# EAGLE design echo (EAGLE 9.3.2)
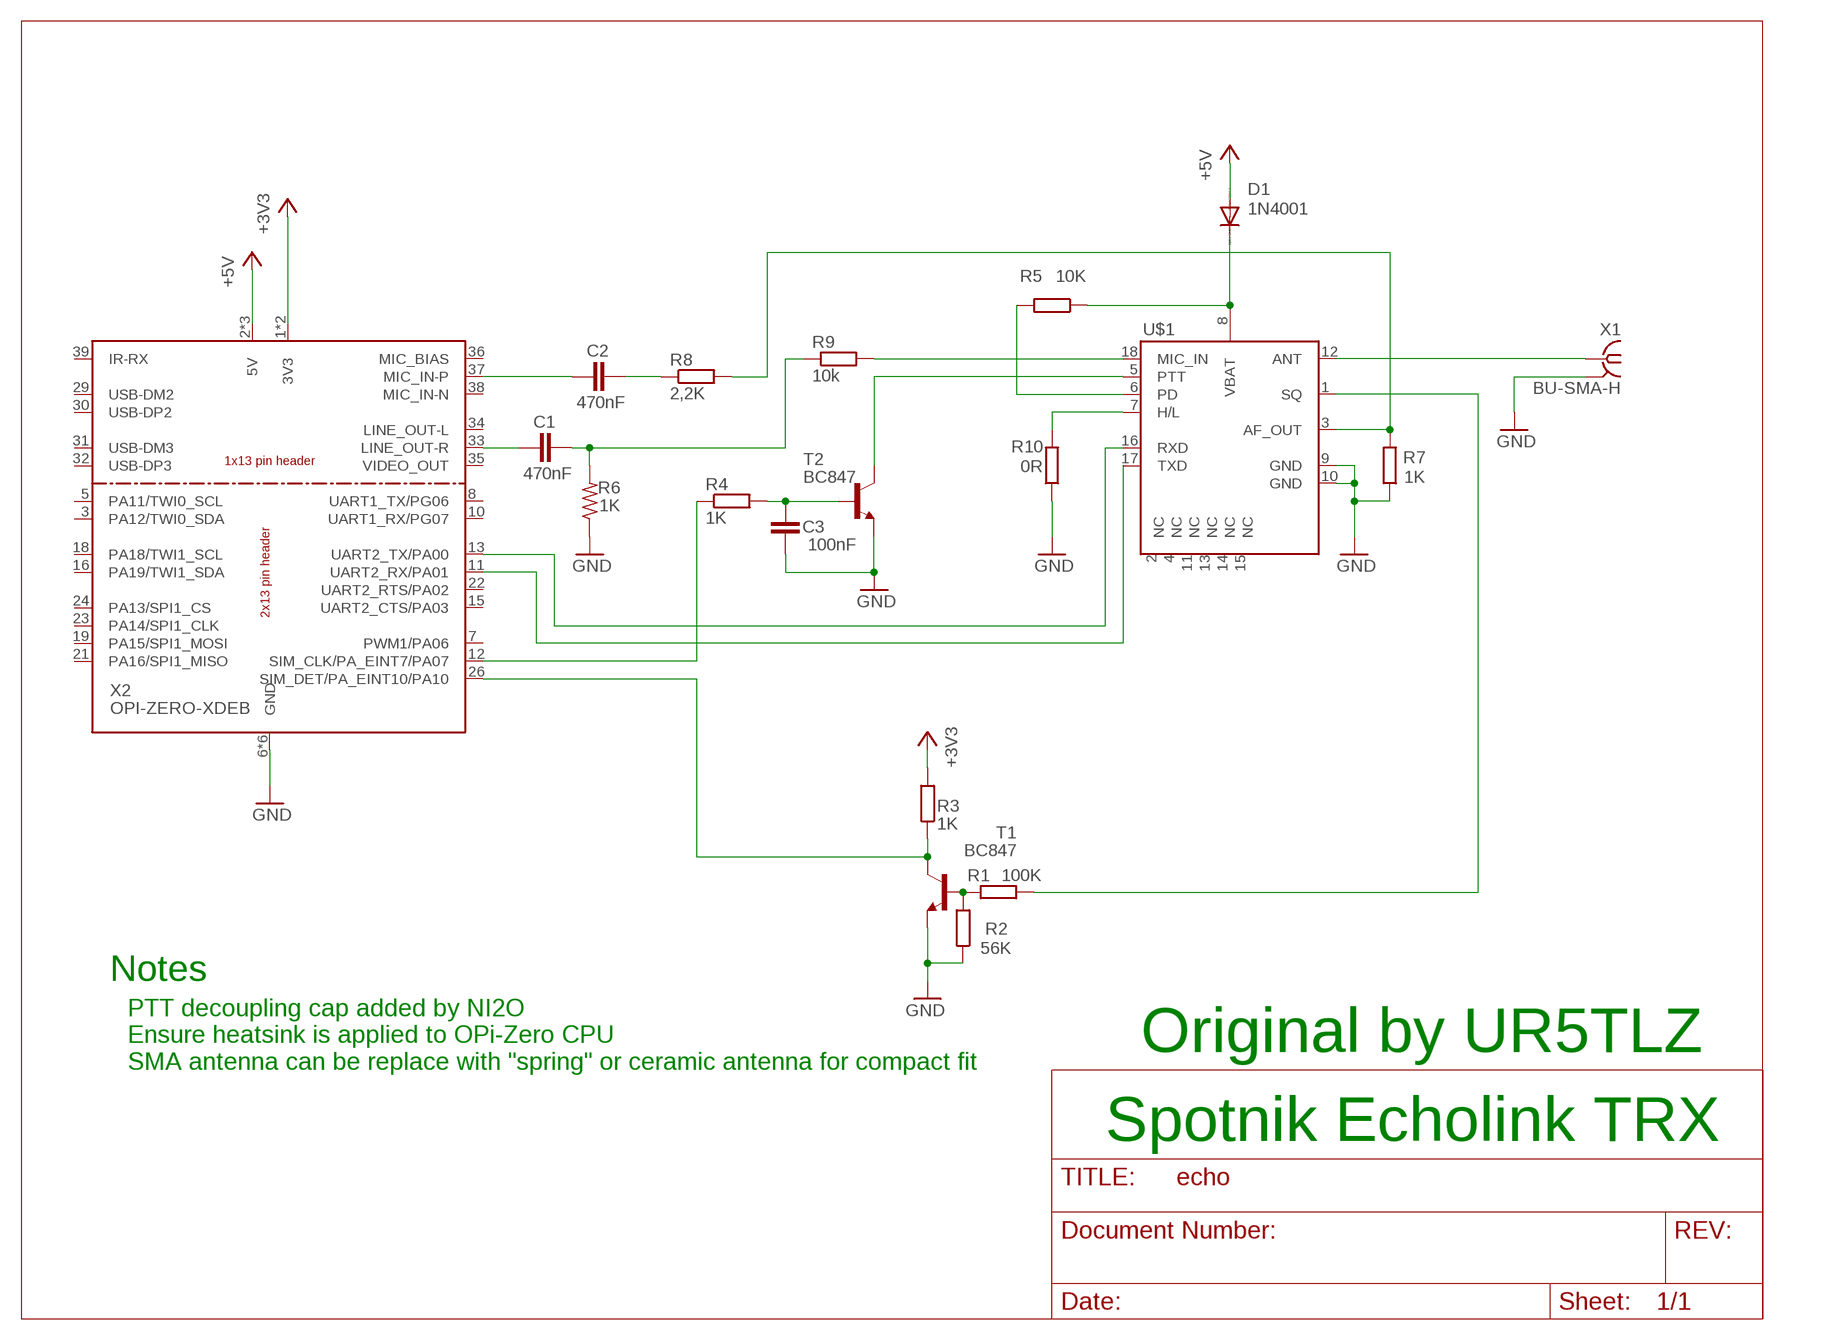
[diagram p0: schematic, sheet 1]

## Parts
C1  470nF  C-EUC0805  [C0805]
C2  470nF  C-EUC0805  [C0805]
C3  100nF  C-EUC0805  [C0805]
D1  1N4001  DIODE-DO41-10  [DO41-10]
R1  100K  R-EU_R0805  [R0805]
R2  56K  R-EU_R0805  [R0805]
R3  1K  R-EU_R0805  [R0805]
R4  1K  R-EU_R0805  [R0805]
R5  10K  R-EU_R0805  [R0805]
R6  1K  R-US_R0805  [R0805]
R7  1K  R-EU_R0805  [R0805]
R8  2,2K  R-EU_R0805  [R0805]
R9  10k  R-EU_R0805  [R0805]
R10  0R  R-EU_R0805  [R0805]
T1  BC847  [SOT23]
T2  BC847  [SOT23]
U$1  DRA818A  [DRA818A]
X1  BU-SMA-H  [BU-SMA-H]
X2  OPI-ZERO-XDEB  [OPIOHATDEB]

## Nets
+3V3: R3.2 X2.1(3V3) X2.17(3V3)
+5V: D1.A X2.2(5V) X2.4(5V) X2.27(5V)
GND: C3.2 R2.1 R6.1 R7.1 R10.1 T1.2(E) T2.2(E) U$1.9(GND) U$1.10(GND) X1.2 X1.3 X1.4 X1.5 X2.6(GND) X2.9(GND) X2.14(GND) X2.20(GND) X2.25(GND) X2.28(GND)
N$1: U$1.12(ANT) X1.1
N$2: R1.2 R2.2 T1.1(B)
N$3: R3.1 T1.3(C) X2.26(SIM_DET/PA_EINT10/PA10)
N$4: D1.C R5.1 U$1.8(VBAT)
N$5: R1.1 U$1.1(SQ)
N$6: C3.1 R4.2 T2.1(B)
N$7: T2.3(C) U$1.5(PTT)
N$8: R4.1 X2.12(SIM_CLK/PA_EINT7/PA07)
N$9: R5.2 U$1.6(PD)
N$10: C1.2 X2.33(LINE_OUT-R)
N$11: C1.1 R6.2 R9.1
N$12: R7.2 R8.2 U$1.3(AF_OUT)
N$13: C2.1 R8.1
N$14: C2.2 X2.37(MIC_IN-P)
N$15: U$1.17(TXD) X2.11(UART2_RX/PA01)
N$16: U$1.16(RXD) X2.13(UART2_TX/PA00)
N$17: R9.2 U$1.18(MIC_IN)
N$18: R10.2 U$1.7(H/L)
Unconnected: U$1.2(NC) U$1.4(NC) U$1.11(NC) U$1.13(NC) U$1.14(NC) U$1.15(NC) X2.3(PA12/TWI0_SDA) X2.5(PA11/TWI0_SCL) X2.7(PWM1/PA06) X2.8(UART1_TX/PG06) X2.10(UART1_RX/PG07) X2.15(UART2_CTS/PA03) X2.16(PA19/TWI1_SDA) X2.18(PA18/TWI1_SCL) X2.19(PA15/SPI1_MOSI) X2.21(PA16/SPI1_MISO) X2.22(UART2_RTS/PA02) X2.23(PA14/SPI1_CLK) X2.24(PA13/SPI1_CS) X2.29(USB-DM2) X2.30(USB-DP2) X2.31(USB-DM3) X2.32(USB-DP3) X2.34(LINE_OUT-L) X2.35(VIDEO_OUT) X2.36(MIC_BIAS) X2.38(MIC_IN-N) X2.39(IR-RX)

## Notes on the sheet
- Notes
- Original by UR5TLZ
- PTT decoupling cap added by NI2O
  Ensure heatsink is applied to OPi-Zero CPU
  SMA antenna can be replace with "spring" or ceramic antenna for compact fit
- Spotnik Echolink TRX

## Library data of the parts
C1-C3 = resistor:C-EU: CAPACITOR, European symbol
D1 = diode:DIODE-: DIODE
R1-R5 R7-R10 = resistor:R-EU_: RESISTOR, European symbol
R6 = resistor:R-US_: RESISTOR, American symbol
T1 T2 = transistor:BC847: NPN TRANSISTOR
U$1 = dorji:DRA818A
X1 = con-coax:BU-SMA-H: FEMALE SMA CONNECTOR Radiall; OC_FARNELL: unknown; OC_NEWARK: unknown
X2 = OrangePi0:OPI-ZERO-X

## Board
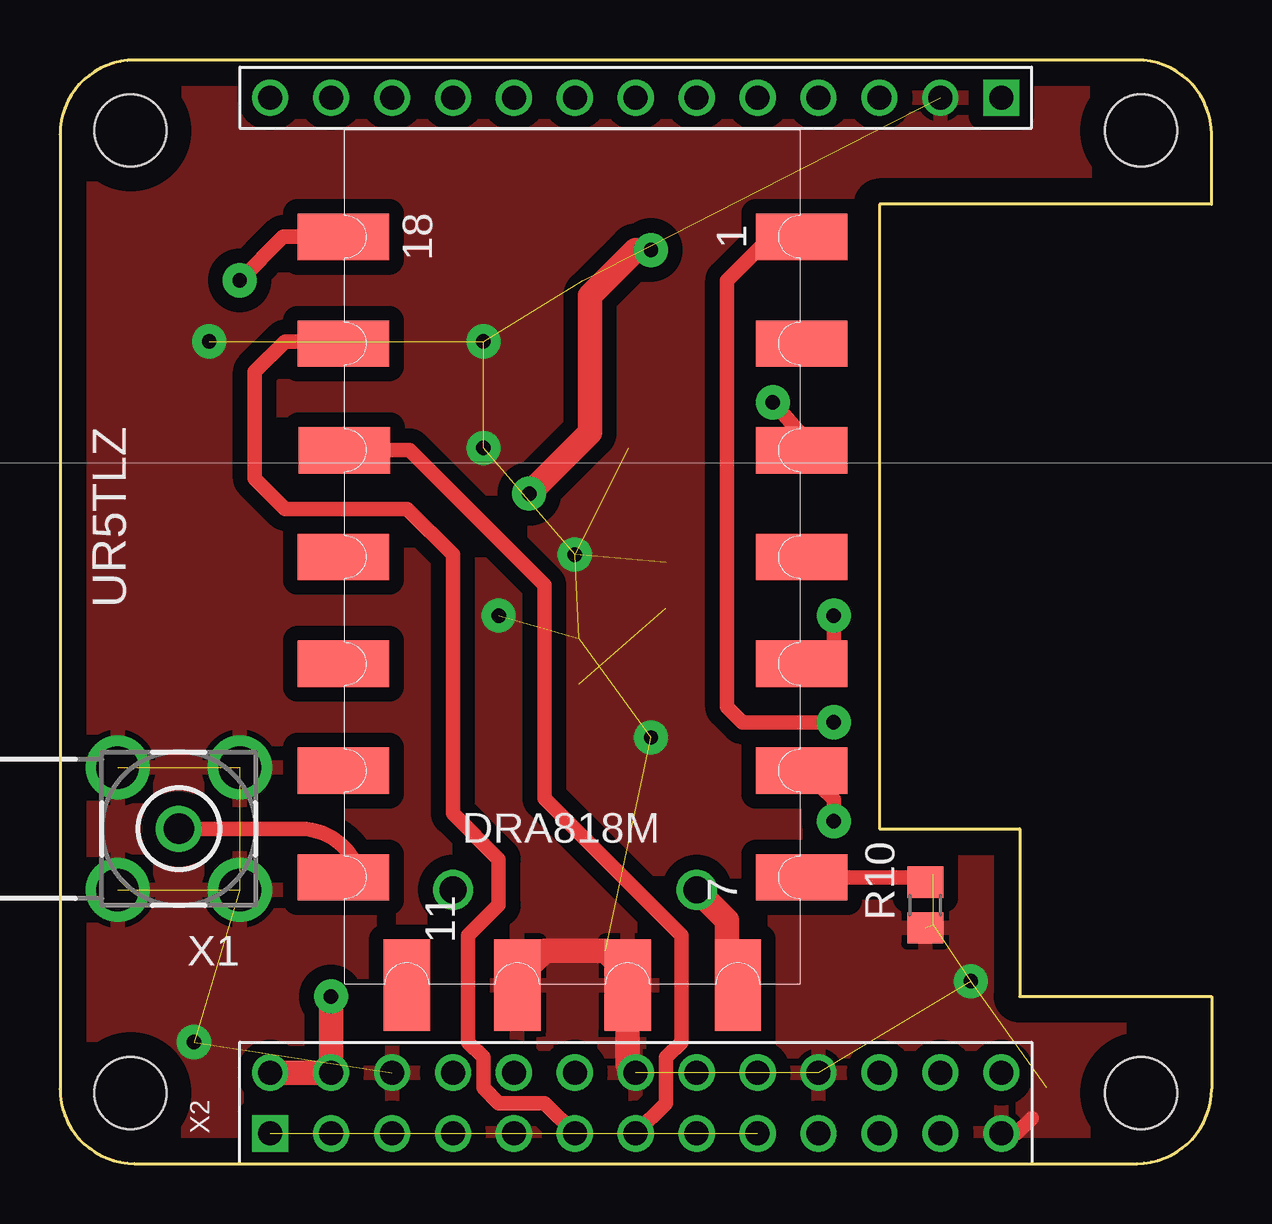
[diagram p1: board, top side]
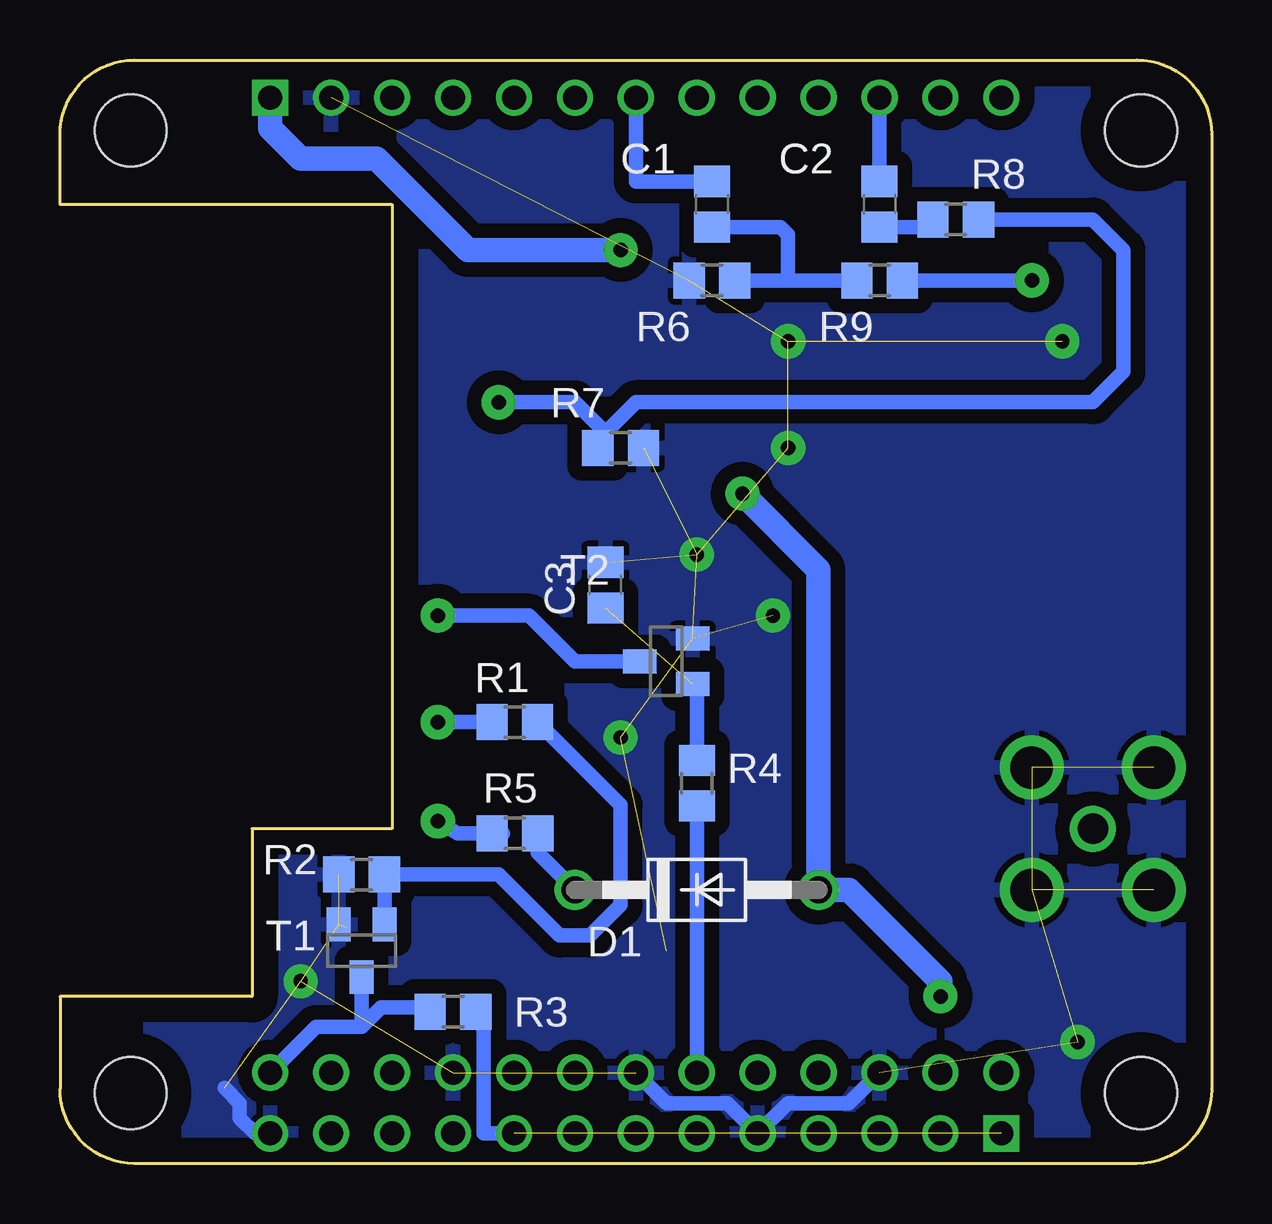
[diagram p2: board, bottom side, seen from below]

Size 48 x 46 mm. Coordinates in mm from the lower left corner, seen from the top.
Copper layers (1*16): Top 0.035mm / dielectric 1.5mm / Bottom 0.035mm
Design rules "default *": minimum track width 10mil, minimum drill 24mil, track to track 8mil, track to pad 8mil, pad to pad 8mil, via to via 8mil, smd to smd 8mil, copper to edge 40mil, drill to drill 8mil, minimum pad ring 10mil, minimum via ring 8mil, stop-mask expansion 4mil, vias tented up to drill 25mil, thermal gap 10mil

### Footprints (pad centres in the part's own frame; a part is rotated, then mirrored left to right if it is on the bottom)
C0805 = smd 1.3 x 1.5: 1 -0.95,0; 2 0.95,0
DO41-10 = drill 1.118: A 5.08,0; C -5.08,0
R0805 = smd 1.3 x 1.5: 1 -0.95,0; 2 0.95,0
SOT23 = smd 1 x 1.4: 1 -0.95,-1.1; 2 0.95,-1.1; 3 0,1.1
DRA818A = smd 3.81 x 1.93: 1 -9.45,-13.25; 2 -9.45,-8.8; 3 -9.45,-4.35; 4 -9.45,0.1; 5 -9.45,4.55; 6 -9.45,9; 7 -9.45,13.45; 12 9.65,13.45; 13 9.65,9; 14 9.65,4.55; 15 9.65,0.1; 16 9.6,-4.35; 17 9.65,-8.8; 18 9.65,-13.25 | smd 1.93 x 3.81: 8 -6.8,17.95; 9 -2.2,17.95; 10 2.4,17.95; 11 7,17.95
BU-SMA-H = drill 1.27: 1 0,0 | drill 1.778: 2 -2.55,2.55; 3 2.55,2.55; 4 2.55,-2.55; 5 -2.55,-2.55
OPIOHATDEB = drill 1 square: 1 0,0; 27 30.48,43.18 | drill 1: 2 0,2.54; 3 2.54,0; 4 2.54,2.54; 5 5.08,0; 6 5.08,2.54; 7 7.62,0; 8 7.62,2.54; 9 10.16,0; 10 10.16,2.54; 11 12.7,0; 12 12.7,2.54; 13 15.24,0; 14 15.24,2.54; 15 17.78,0; 16 17.78,2.54; 17 20.32,0; 18 20.32,2.54; 19 22.86,0; 20 22.86,2.54; 21 25.4,0; 22 25.4,2.54; 23 27.94,0; 24 27.94,2.54; 25 30.48,0; 26 30.48,2.54; 28 27.94,43.18; 29 25.4,43.18; 30 22.86,43.18; 31 20.32,43.18; 32 17.78,43.18; 33 15.24,43.18; 34 12.7,43.18; 35 10.16,43.18; 36 7.62,43.18; 37 5.08,43.18; 38 2.54,43.18; 39 0,43.18 | hole 3: -5.815,1.694; 36.295,1.694; 36.295,41.805; -5.815,41.805

### Placement (x,y rotation side)
C1  20.82,39.99 90 bottom
C2  13.84,39.99 90 bottom
C3  25.27,24.11 90 bottom
D1  21.46,11.41 0 bottom
R1  29.04,18.41 0 bottom
R2  35.43,12.05 0 bottom
R3  31.62,6.33 0 bottom
R4  21.46,15.86 90 bottom
R5  29.04,13.77 180 bottom
R6  20.82,36.81 0 bottom
R7  24.63,29.83 180 bottom
R8  10.66,39.35 0 bottom
R9  13.84,36.81 0 bottom
R10  36.06,10.78 90 top
T1  35.43,8.87 180 bottom
T2  22.73,20.94 90 bottom
U$1  21.46,25.38 180 top
X1  4.95,13.95 180 top
X2  8.76,1.25 0 top

### Tracks (layer width: path | path; a pad name or v marks a point on that pad's centre or on a via)
+3V3  (1 unrouted)
  Bottom 0.61: X2.17 30.35,1.25 30.35,6.33 R3.2
+5V  (via drill 0.6 pad 1.42)
  Top 1.016: X2.2 X2.4 v11.3,6.97 | v24.63,38.08 24,38.08 22.09,36.18 22.09,30.46 v19.55,27.92
  Bottom 1.016: v11.3,6.97 11.3,7.6 15.11,11.41 D1.A 16.38,24.75 v19.55,27.92 | X2.27 39.24,43.16 37.97,41.89 34.79,41.89 30.98,38.08 v24.63,38.08
GND  (via drill 0.6 pad 1.42)  (22 unrouted)
  Top 0.61: X2.25 39.87,1.25 40.51,1.89
  Top 1.016: U$1.10 19.06,7.74 20.19,8.87 22.73,8.87 23.66,7.94 U$1.9 23.66,4.13 X2.14
  Bottom 0.61: X2.14 22.73,2.52 20.19,2.52 X2.9 17.65,2.52 15.11,2.52 X2.6 | X2.25 39.87,1.25 40.51,1.89 40.51,2.52 41.14,3.16
  other vias: 6.22,34.27 18.28,22.84 21.46,25.38 17.65,34.27 17.65,29.83 5.58,5.06 24.63,17.76 37.97,7.6
  pour Top (isolate 0.61): -0.13,46.34 -0.13,-0.02 48.13,-0.02 48.13,46.34
  pour Bottom (isolate 0.61): -0.13,46.34 48.13,46.34 48.13,-0.02 -0.13,-0.02
N$1
  Top 0.61: U$1.12 11.81,11.41 12.57,11.41 arc90 10.03,13.95 X1.1
N$2
  Bottom 0.61: T1.1 R2.2 29.71,12.05 27.17,9.51 25.9,9.51 24.63,10.78 24.63,14.95 R1.2
N$3
  Bottom 0.61: R3.1 32.74,6.5 34.62,6.5 35.43,5.7 | T1.3 35.43,5.7 | X2.26 37.33,5.7 35.43,5.7
N$4
  Top 0.61: U$1.8 28.26,8.42 | 28.26,8.42 27.81,8.87 | 28.26,8.42 28.63,8.42
  Top 1.016: 27.81,8.87 27.81,10.14 D1.C
  Bottom 0.61: R5.1 28.09,12.96 D1.C
N$5  (via drill 0.6 pad 1.42)
  Top 0.61: v32.25,18.4 28.44,18.4 27.81,19.03 27.81,36.81 29.71,38.72 30.35,39.19 U$1.1
  Bottom 0.61: R1.1 32.24,18.41 v32.25,18.4
N$6  (1 unrouted)
  Bottom 0.61: 21.46,19.99 R4.2
  Bottom 1.016: T2.1 21.46,19.99
N$7  (via drill 0.6 pad 1.42)
  Top 0.61: v32.25,22.84 32.25,20.94 30.8,20.94 | 29.71,20.94 30.8,20.94 | 30.8,20.94 U$1.5
  Bottom 0.61: T2.3 25.27,20.94 26.54,20.94 28.44,22.84 v32.25,22.84
N$8
  Bottom 0.61: R4.1 X2.12
N$9  (via drill 0.6 pad 1.42)
  Top 0.61: U$1.6 32.25,15.19 v32.25,14.27
  Bottom 0.61: R5.2 31.43,13.77 v32.25,14.27 | 29.53,13.77 R5.2 | R5.2 30.16,13.77 30.35,13.95 30.17,13.95 R5.2
N$10
  Bottom 0.61: C1.2 24,40.94 X2.33
N$11
  Bottom 0.61: R9.1 17.65,36.81 | 17.65,36.81 R6.2 20.19,37.13 | C1.1 17.97,39.04 17.65,38.72 17.65,36.81
N$12  (via drill 0.6 pad 1.42)
  Top 0.61: U$1.3 30.91,30.39 v29.71,31.73
  Bottom 0.61: R8.2 4.95,39.35 3.68,38.08 3.68,33 4.95,31.73 24,31.73 25.27,30.46 | v29.71,31.73 26.54,31.73 25.27,30.46 | 25.27,30.46 25.27,30.14 R7.2
N$13
  Bottom 0.61: C2.1 11.93,39.04 R8.1
N$14
  Bottom 0.61: C2.2 X2.37
N$15
  Top 0.61: X2.11 20.19,2.52 18.28,2.52 17.65,3.16 17.65,4.43 17.01,5.06 17.01,9.51 18.28,10.78 18.28,12.68 16.38,14.59 16.38,25.38 14.47,27.29 9.39,27.29 8.12,28.56 8.12,33 9.39,34.27 11.72,34.27 U$1.17
N$16
  Top 0.61: X2.13 25.27,2.52 25.27,4.43 25.9,5.06 25.9,9.51 20.19,15.22 20.19,24.11 14.57,29.73 U$1.16
N$17  (via drill 0.6 pad 1.42)
  Top 0.61: U$1.18 9.31,38.63 v7.49,36.81
  Bottom 0.61: v7.49,36.81 R9.2
N$18
  Top 0.61: U$1.7 35.86,11.93 R10.2

### Text on the board
tPlace: UR5TLZ